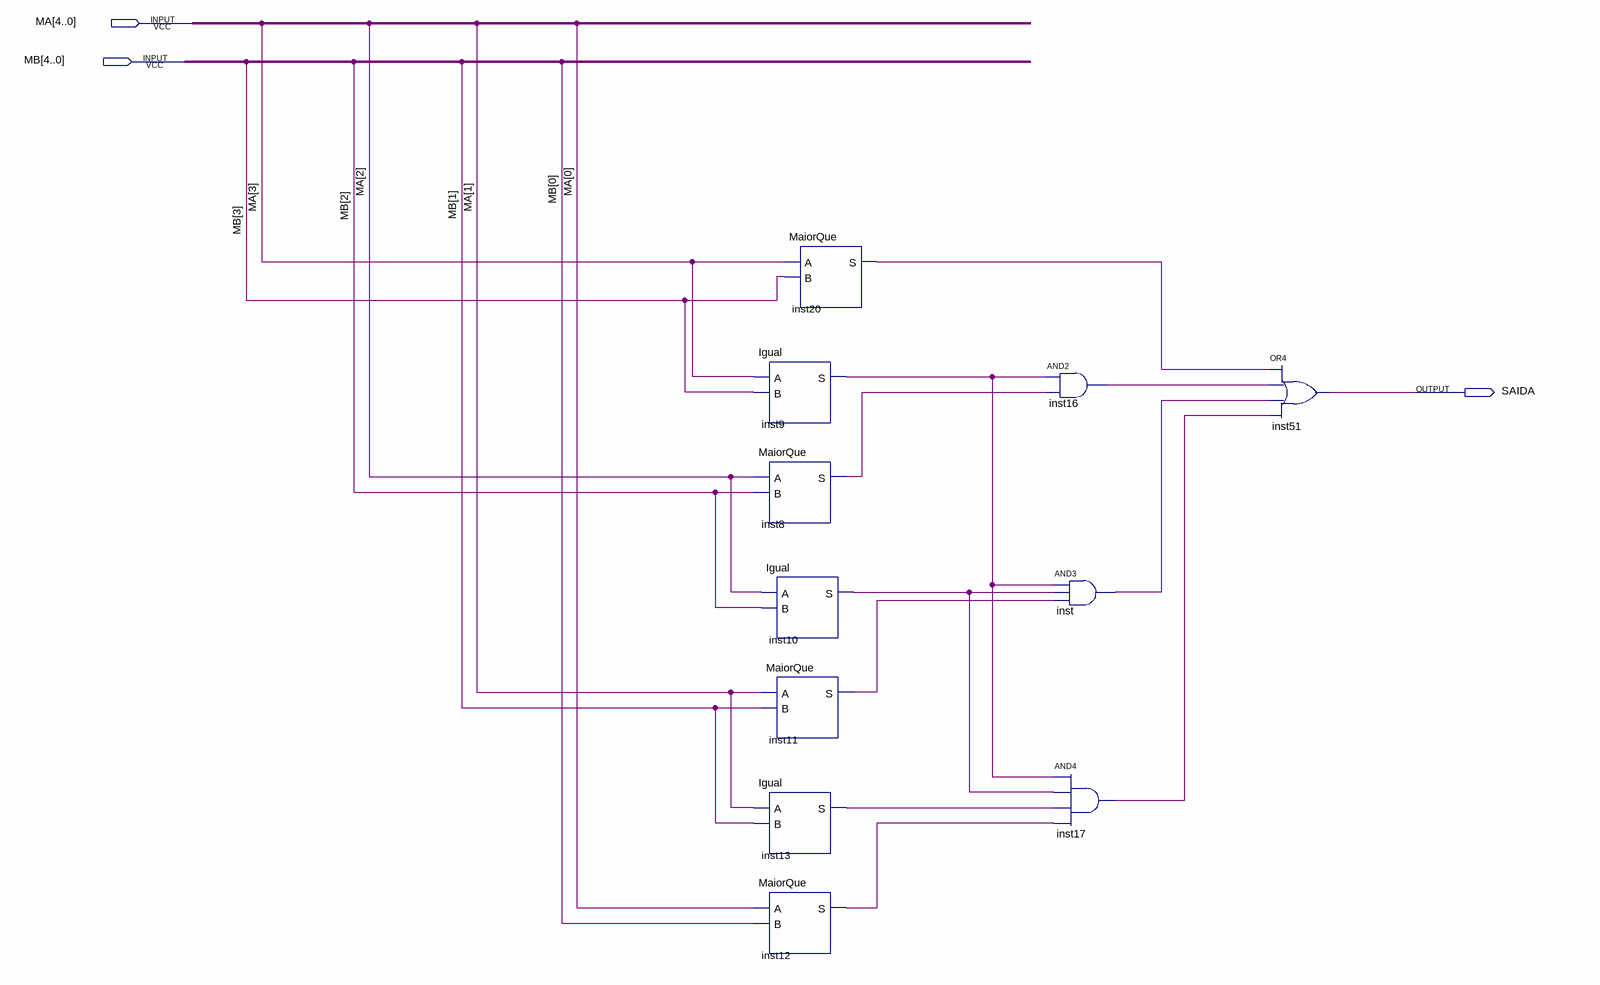
[diagram p0: schematic sheet]
// Quartus schematic MaiorQueSomadorOK.bdf as structural Verilog: 11 symbols, 3 pins
module MaiorQueSomadorOK (
  input  [4:0] MA,
  input  [4:0] MB,
  output SAIDA
);

  wire inst8_s, inst9_s, inst10_s, inst11_s, inst12_s, inst13_s, inst16_out, inst17_out, inst20_s, inst_out;

  MaiorQue inst20 (.A(MA[3]), .B(MB[3]), .S(inst20_s));
  Igual inst9 (.A(MA[3]), .B(MB[3]), .S(inst9_s));
  MaiorQue inst8 (.A(MA[2]), .B(MB[2]), .S(inst8_s));
  Igual inst10 (.A(MA[2]), .B(MB[2]), .S(inst10_s));
  MaiorQue inst11 (.A(MA[1]), .B(MB[1]), .S(inst11_s));
  Igual inst13 (.A(MA[1]), .B(MB[1]), .S(inst13_s));
  MaiorQue inst12 (.A(MA[0]), .B(MB[0]), .S(inst12_s));
  and inst16 (inst16_out, inst9_s, inst8_s);
  and inst (inst_out, inst9_s, inst10_s, inst11_s);
  and inst17 (inst17_out, inst9_s, inst10_s, inst13_s, inst12_s);
  or inst51 (SAIDA, inst20_s, inst16_out, inst_out, inst17_out);
endmodule
